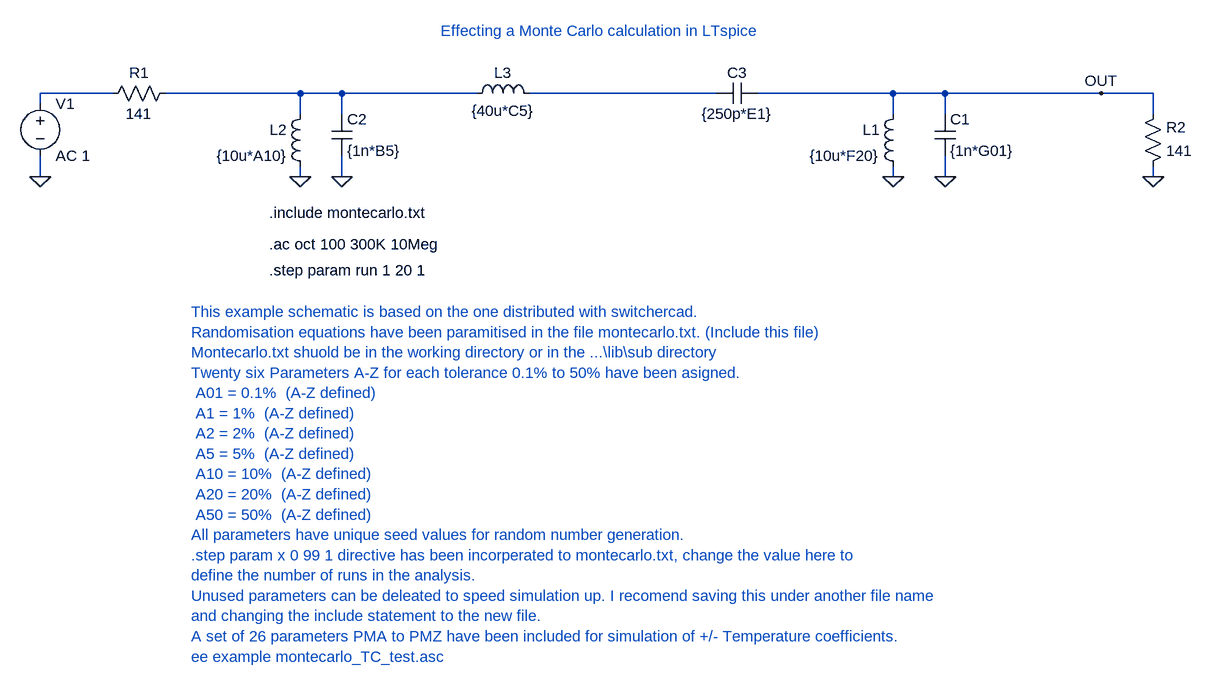
[diagram p0: schematic MonteCarlo.asc]
MonteCarlo.asc, the LTspice schematic file:
Version 4
SHEET 1 1372 1452
WIRE -512 368 -512 336
WIRE -512 256 -512 240
WIRE -512 240 -400 240
WIRE -112 240 -48 240
WIRE 880 240 880 272
WIRE 880 336 880 368
WIRE 800 240 800 272
WIRE 800 352 800 368
WIRE 800 240 880 240
WIRE -48 240 -48 272
WIRE -48 336 -48 368
WIRE -112 240 -112 272
WIRE -112 352 -112 368
WIRE -48 240 160 240
WIRE -320 240 -112 240
WIRE 1200 368 1200 352
WIRE 1200 272 1200 240
WIRE 1200 240 1120 240
WIRE 240 240 528 240
WIRE 592 240 800 240
WIRE 1120 240 880 240
FLAG 880 368 0
FLAG -512 368 0
FLAG 800 368 0
FLAG -48 368 0
FLAG -112 368 0
FLAG 1200 368 0
FLAG 1120 240 OUT
SYMBOL cap 864 272 R0
SYMATTR InstName C1
SYMATTR Value {1n*G01}
SYMBOL voltage -512 240 R0
SYMATTR InstName V1
SYMATTR Value AC 1
SYMBOL ind 816 256 M0
SYMATTR InstName L1
SYMATTR Value {10u*F20}
SYMBOL cap -64 272 R0
SYMATTR InstName C2
SYMATTR Value {1n*B5}
SYMBOL ind -96 256 M0
SYMATTR InstName L2
SYMATTR Value {10u*A10}
SYMBOL res -304 224 R90
WINDOW 0 0 56 VBottom 0
WINDOW 3 32 56 VTop 0
SYMATTR InstName R1
SYMATTR Value 141
SYMBOL res 1184 368 M180
WINDOW 0 36 76 Left 0
WINDOW 3 36 40 Left 0
SYMATTR InstName R2
SYMATTR Value 141
SYMBOL ind 256 256 M270
WINDOW 0 32 56 VTop 0
WINDOW 3 5 56 VBottom 0
SYMATTR InstName L3
SYMATTR Value {40u*C5}
SYMBOL cap 592 224 R90
WINDOW 0 0 32 VBottom 0
WINDOW 3 32 32 VTop 0
SYMATTR InstName C3
SYMATTR Value {250p*E1}
TEXT -160 472 Left 0 !.ac oct 100 300K 10Meg
TEXT -160 424 Left 0 !.include montecarlo.txt
TEXT 104 144 Left 0 ;Effecting a Monte Carlo calculation in LTspice
TEXT -280 576 Left 0 ;This example schematic is based on the one distributed with switchercad.\nRandomisation equations have been paramitised in the file montecarlo.txt. (Include this file)\nMontecarlo.txt shuold be in the working directory or in the ...\\lib\\sub directory\nTwenty six Parameters A-Z for each tolerance 0.1% to 50% have been asigned.\n A01 = 0.1%  (A-Z defined)\n A1 = 1%  (A-Z defined)\n A2 = 2%  (A-Z defined)\n A5 = 5%  (A-Z defined)\n A10 = 10%  (A-Z defined)\n A20 = 20%  (A-Z defined)\n A50 = 50%  (A-Z defined)\nAll parameters have unique seed values for random number generation.\n.step param x 0 99 1 directive has been incorperated to montecarlo.txt, change the value here to\ndefine the number of runs in the analysis.\nUnused parameters can be deleated to speed simulation up. I recomend saving this under another file name \nand changing the include statement to the new file.\nA set of 26 parameters PMA to PMZ have been included for simulation of +/- Temperature coefficients.\nee example montecarlo_TC_test.asc
TEXT -160 512 Left 0 !.step param run 1 20 1

The netlist it stands for:
* MonteCarlo.asc
C1 OUT 0 {1n*G01}
V1 N001 0 AC 1
L1 OUT 0 {10u*F20}
C2 N002 0 {1n*B5}
L2 N002 0 {10u*A10}
R1 N002 N001 141
R2 0 OUT 141
L3 N003 N002 {40u*C5}
C3 OUT N003 {250p*E1}
.ac oct 100 300K 10Meg
.include montecarlo.txt
* Effecting a Monte Carlo calculation in LTspice
* This example schematic is based on the one distributed with switchercad.
* Randomisation equations have been paramitised in the file montecarlo.txt. (Include this file)
* Montecarlo.txt shuold be in the working directory or in the ...\lib\sub directory
* Twenty six Parameters A-Z for each tolerance 0.1% to 50% have been asigned.
*  A01 = 0.1%  (A-Z defined)
*  A1 = 1%  (A-Z defined)
*  A2 = 2%  (A-Z defined)
*  A5 = 5%  (A-Z defined)
*  A10 = 10%  (A-Z defined)
*  A20 = 20%  (A-Z defined)
*  A50 = 50%  (A-Z defined)
* All parameters have unique seed values for random number generation.
* .step param x 0 99 1 directive has been incorperated to montecarlo.txt, change the value here to
* define the number of runs in the analysis.
* Unused parameters can be deleated to speed simulation up. I recomend saving this under another file name
* and changing the include statement to the new file.
* A set of 26 parameters PMA to PMZ have been included for simulation of +/- Temperature coefficients.
* ee example montecarlo_TC_test.asc
.step param run 1 20 1
.backanno
.end